# Altium schematic sheet HC595.SchDoc
size A4; DocumentNumber: 5; SheetNumber: ALT0056; SheetTotal: 21
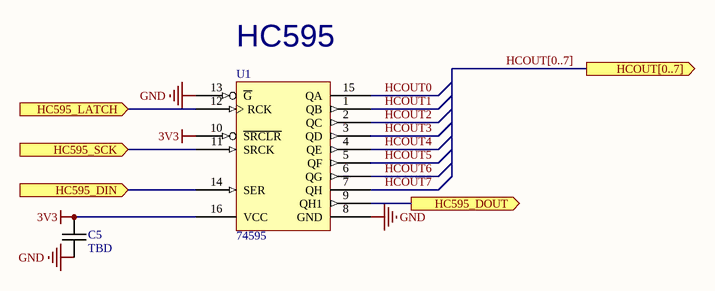
[diagram p0: HC595.SchDoc]

## Parts
C5  TBD  [1210C-GENERIC]
U1  74595  [SO16]

## Ports
HC595_DIN (in), HC595_DOUT (out), HC595_LATCH (in), HC595_SCK (in), HCOUT[0..7] (out)

## Nets
3V3: C5.1 U1.10(~{SRCLR}) U1.16(VCC)
GND: C5.2 U1.8(GND) U1.13(~{G})
HC595_DIN: U1.14(SER) ; port HC595_DIN
HC595_DOUT: U1.9(QH1) ; port HC595_DOUT
HC595_LATCH: U1.12(RCK) ; port HC595_LATCH
HC595_SCK: U1.11(SRCK) ; port HC595_SCK
HCOUT0: U1.15(QA)
HCOUT1: U1.1(QB)
HCOUT2: U1.2(QC)
HCOUT3: U1.3(QD)
HCOUT4: U1.4(QE)
HCOUT5: U1.5(QF)
HCOUT6: U1.6(QG)
HCOUT7: U1.7(QH)

## Buses and harness runs
bus HCOUT[0..7] = port HCOUT[0..7]

## Notes on the sheet
- (near U1) HC595
- Title
- Size:
- Date:
- A4
- Number:
- Time:
- Revision:
- Sheet
- of
- File:

## Library data of the parts
C5 = Passives_Capacitors_1210_1210C-TBD: CAPACITOR 1210 CERAMIC VALUE TO BE DETERMINED
U1 = 74595: 8-BIT SFT REG WIRTH OUTPUT LCH